# Altium schematic sheet SAM_Dispenser_2.SchDoc
size A4; SheetNumber: 2; SheetTotal: 2
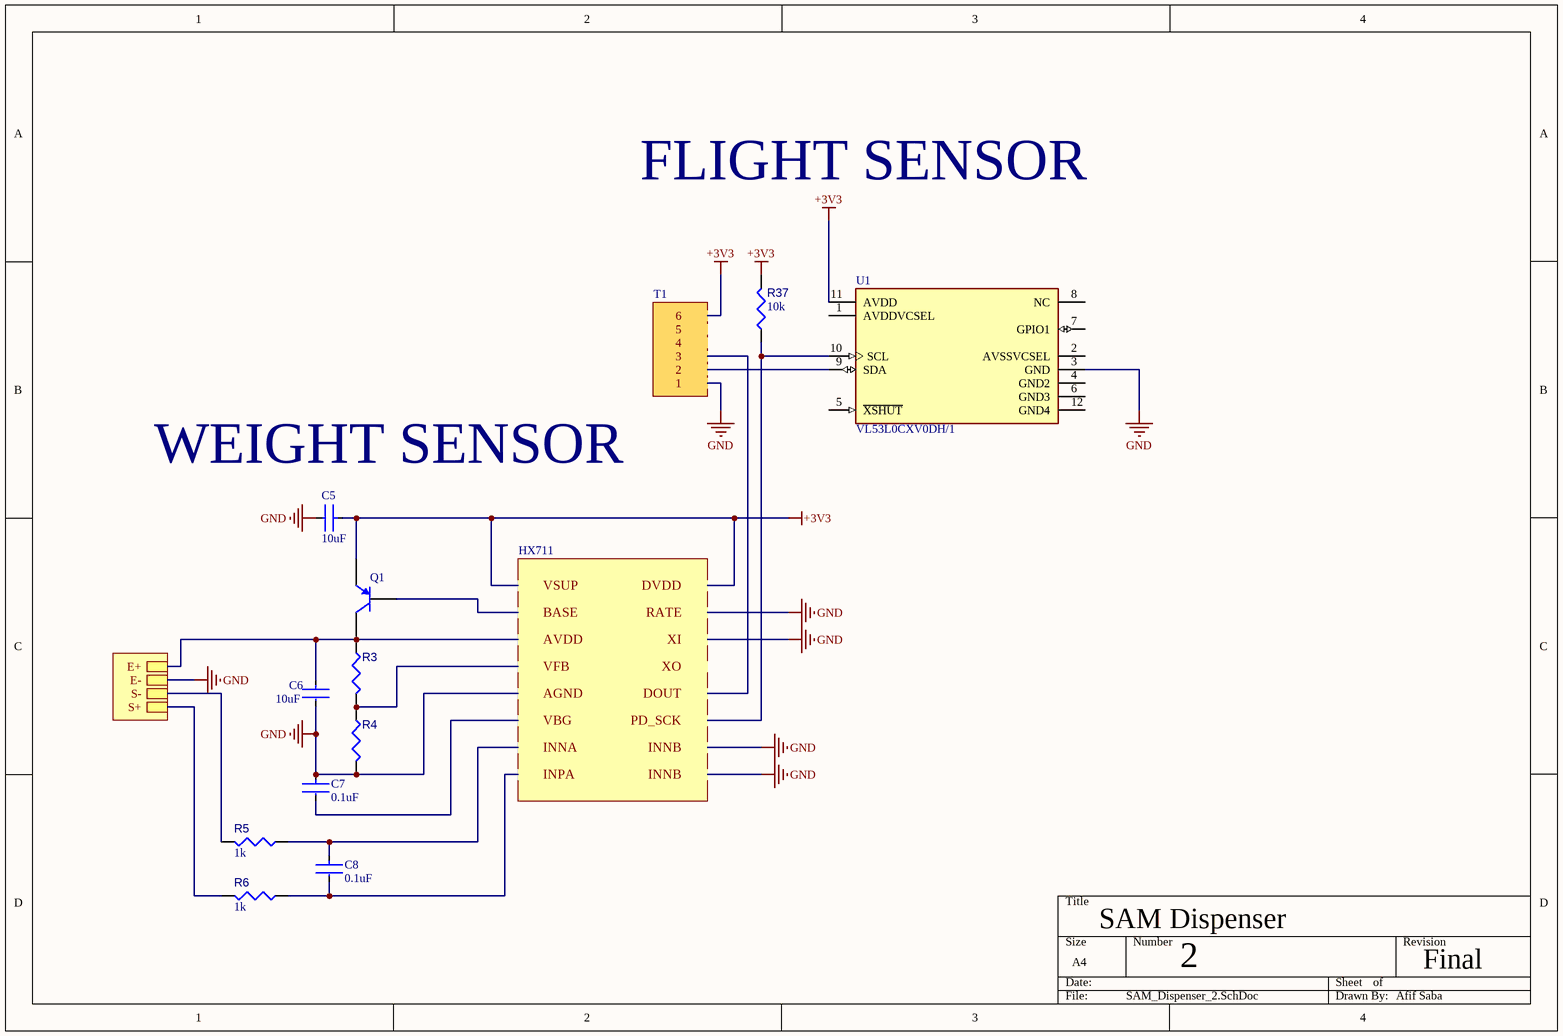
[diagram p0: SAM_Dispenser_2.SchDoc]

## Parts
C5  Parameter 1: 10uF  [4.7uF400V]  (hidden comment: 475CKE400M)
C6  Parameter 1: 10uF  [4.7uF400V]  (hidden comment: 475CKE400M)
C7  Parameter 1: 0.1uF  [4.7uF400V]  (hidden comment: 475CKE400M)
C8  Parameter 1: 0.1uF  [4.7uF400V]  (hidden comment: 475CKE400M)
Q1  PN2907ABU  [FAIR-TO-92]  (value not drawn)
R3  3KR2F  [RESC0402(1005)_L]  (value not drawn)
R4  3KR2F  [RESC0402(1005)_L]  (value not drawn)
R5  R34: 1k  [RESC0402(1005)_L]  (hidden comment: 3KR2F)
R6  R34: 1k  [RESC0402(1005)_L]  (hidden comment: 3KR2F)
R37  R34: 10k  [RESC0402(1005)_L]  (hidden comment: 3KR2F)
U1  VL53L0CXV0DH/1  [FP-LGA-12-MFG]

## Sub-sheets
Designator = HX711: VSUP, BASE, AVDD, VFB, AGND, VBG, INNA, INPA, DVDD, RATE, XI, XO, DOUT, PD_SCK, INNB, INNB
Designator = File Name: E+, E-, S-, S+
T1 = File Name: 1, 2, 3, 4, 5, 6

## Nets
+3V3: C5.1 Q1.1(E) R37.2 U1.11(AVDD) ; sheet T1/6, sheet Designator/VSUP, sheet Designator/DVDD
GND: C5.2 C6.2 C7.1 R4.2 U1.3(GND) ; sheet T1/1, sheet Designator/AGND, sheet Designator/RATE, sheet Designator/XI, sheet Designator/INNB, sheet Designator/INNB, sheet Designator/E-
NetC6_1: C6.1 Q1.3(C) R3.1 ; sheet Designator/AVDD, sheet Designator/E+
NetC7_2: C7.2 ; sheet Designator/VBG
NetC8_1: C8.1 R5.1 ; sheet Designator/INNA
NetC8_2: C8.2 R6.1 ; sheet Designator/INPA
NetQ1_2: Q1.2(B) ; sheet Designator/BASE
NetR3_2: R3.2 R4.1 ; sheet Designator/VFB
NetR5_2: R5.2 ; sheet Designator/S-
NetR6_2: R6.2 ; sheet Designator/S+
NetR37_1: R37.1 U1.10(SCL) ; sheet Designator/PD_SCK
NetU1_9: U1.9(SDA) ; sheet T1/2
(unnamed): sheet T1/3, sheet Designator/DOUT

Not connected (* = marked no-connect by the designer): U1 1(AVDDVCSEL) 2(AVSSVCSEL) 4(GND2) 5(~{XSHUT}) 6(GND3) 7(GPIO1) 8(NC) 12(GND4)

## Notes on the sheet
- FLIGHT SENSOR
- (near C5) WEIGHT SENSOR
- SAM Dispenser
- 2
- Final
- Afif Saba

## Library data of the parts
C5-C8 = CMP-003-000022-1: 4.7 µF 400 V Aluminum Electrolytic Capacitors Radial, Can 70.547Ohm @ 120Hz 2000 Hrs @ 105°C; Parameter 2: 00V; Source: NewVoltageReg.SCHLIB; Design Item ID: 475CKE400M
Q1 = CMP-013-00010-2: BJT PNP General Purpose Transistor, 60 V, 800 mA, -55 to 150 degC, 3-Pin TO-92, RoHS, Bulk; Manufacturer: Fairchild Semiconductor; Vce Max: 1.6V; hFE Min: 100; Elements: 1; Frequency: 200MHz; Power: 625mW; Package Reference: TO-92; Package Quantity: 1000; Packaging: Bulk; Min Operating Temperature: -55°C; Pins: 3; RoHS Compliant: True; Datasheet Version: Rev. 1.1.2, 01/2014; Datasheet URL: http://datasheet.octopart.com/PN2907ABU-Fairchild-Semiconductor-datasheet-22973435.pdf; Max Operating Temperature: 150°C; Package Description: 3-Pin Transistor Outline Package, Body Dia 4.79 mm, Pitch 1.27 mm; Mounting Technology: TH; Case/Package: TO-226-3
R3 R4 = CMP-009-00099-1: 3K 0.063W 1% 0402 (1005 Metric)  SMD; Power: 63mW; R34: 1k; Tolerance: 1%; Pins: 2; Case/Package: 0402; Mounting Technology: SMT
R5 R6 R37 = CMP-009-00099-1: 3K 0.063W 1% 0402 (1005 Metric)  SMD; Power: 63mW; Tolerance: 1%; Pins: 2; Case/Package: 0402; Mounting Technology: SMT
U1 = CMP-2000-07484-2: SENSOR OPTICAL 200CM I2C; Manufacturer: STMicroelectronics; Operating Supply Current: 0.016-19mA; Max Supply Voltage: 3.5V; Min Supply Voltage: 1.6V; Height: 1.05mm; Package: LGA-12; Digikey Description: SENSOR OPTICAL 200CM I2C; Device Class L1: Sensors; Device Class L2: Optical Sensors; Temperature Range High: +70°C; Sensor Output: I2C; ComponentLink2URL: https://www.st.com/resource/en/datasheet/vl53l0x.pdf; RoHS: TRUE; Temperature: -20°C to +70°C; Device Class L3: unset; Lead Free: Yes; Temperature Range Low: -20°C; Category: IC; Manufacturer Part Number: VL53L0CXV0DH/1; ComponentLink2Description: Datasheet; Octopart: https://octopart.com/vl53l0cxv0dh%2F1-stmicroelectronics-71168165; Automotive: No